# Altium schematic sheet xmega32A4U.SchDoc: xmega32A4U.sch
size 274 x 210 mm; Date: 4/24/2014 9:03:22 PM; DocumentNumber: Document Number:; Revision: REV:; SheetNumber: 1; DATABASE: /Users/jmoreland/.dropbox-alt/Dropbox/eagle/JCM-Eagle/bom/PARTSDB.TXT; DRAWN: Joseph Moreland
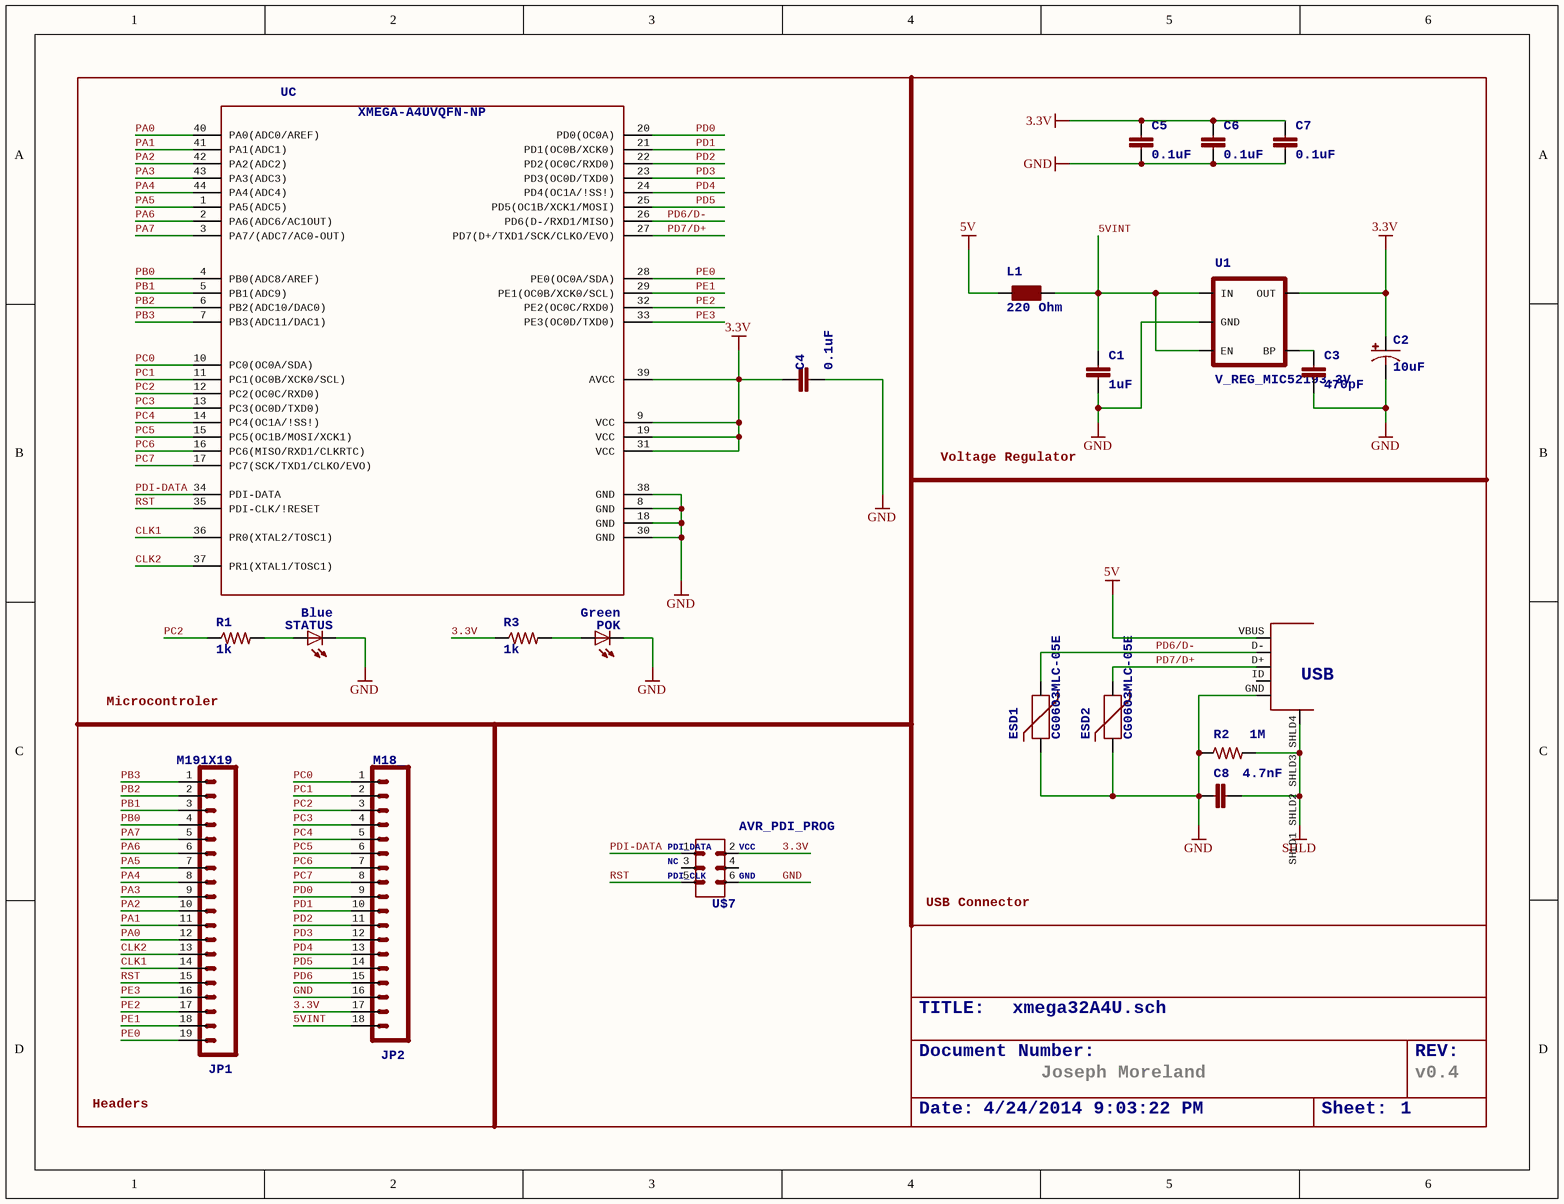
[diagram p0: xmega32A4U.SchDoc]

## Parts
C1  1uF  [0603-CAP]
C2  10uF  [EIA3216]
C3  470pF  [0603-CAP]
C4  0.1uF  [0402-CAP]
C5  0.1uF  [0402-CAP]
C6  0.1uF  [0402-CAP]
C7  0.1uF  [0402-CAP]
C8  4.7nF  [0402-CAP]
ESD1  CG0603MLC-05E  [0603-CHIPGUARD]
ESD2  CG0603MLC-05E  [0603-CHIPGUARD]
JP1  M191X19  [1X19]
JP2  M18_  [1X18]
L1  220 Ohm  [0603]
POK  Green  [LED-0603]
R1  1k  [0603-RES]
R2  1M  [0402-RES]
R3  1k  [0603-RES]
STATUS  Blue  [LED-0603]
U1  V_REG_MIC52193.3V  [SOT23-5]
U$4  USB-MINIB  [USB-MINI-B-UX60-MB-5S8]  (value not drawn)
U$7  AVR_PDI_PROG  [AVR_50MIL_PROG]
UC  XMEGA-A4UVQFN-NP  [QFN44-NOPAD]

## Nets
3.3V: C2.A(+) C4.1 C5.1 C6.1 C7.1 JP2.17 R3.1 U1.5(OUT) U$7.2(VCC) UC.9(VCC) UC.19(VCC) UC.31(VCC) UC.39(AVCC)
5V: L1.1 U$4.VBUS
GND: C1.2 C2.C(-) C3.2 C4.2 C5.2 C6.2 C7.2 C8.1 ESD1.P$1 ESD2.P$1 JP2.16 POK.C R2.1 STATUS.C U1.2(GND) U$4.GND U$7.6(GND) UC.8(GND) UC.18(GND) UC.30(GND) UC.38(GND)
SHLD: C8.2 R2.2 U$4.SHLD1_SHLD2_SHLD3_SHLD4(SHLD)
5VINT: C1.1 JP2.18 L1.2 U1.1(IN) U1.3(EN)
CLK1: JP1.14 UC.36(PR0(XTAL2/TOSC1))
CLK2: JP1.13 UC.37(PR1(XTAL1/TOSC1))
PA0: JP1.12 UC.40(PA0(ADC0/AREF))
PA1: JP1.11 UC.41(PA1(ADC1))
PA2: JP1.10 UC.42(PA2(ADC2))
PA3: JP1.9 UC.43(PA3(ADC3))
PA4: JP1.8 UC.44(PA4(ADC4))
PA5: JP1.7 UC.1(PA5(ADC5))
PA6: JP1.6 UC.2(PA6(ADC6/AC1OUT))
PA7: JP1.5 UC.3(PA7/(ADC7/AC0-OUT))
PB0: JP1.4 UC.4(PB0(ADC8/AREF))
PB1: JP1.3 UC.5(PB1(ADC9))
PB2: JP1.2 UC.6(PB2(ADC10/DAC0))
PB3: JP1.1 UC.7(PB3(ADC11/DAC1))
PC0: JP2.1 UC.10(PC0(OC0A/SDA))
PC1: JP2.2 UC.11(PC1(OC0B/XCK0/SCL))
PC2: JP2.3 R1.1 UC.12(PC2(OC0C/RXD0))
PC3: JP2.4 UC.13(PC3(OC0D/TXD0))
PC4: JP2.5 UC.14(PC4(OC1A/!SS!))
PC5: JP2.6 UC.15(PC5(OC1B/MOSI/XCK1))
PC6: JP2.7 UC.16(PC6(MISO/RXD1/CLKRTC))
PC7: JP2.8 UC.17(PC7(SCK/TXD1/CLKO/EVO))
PD0: JP2.9 UC.20(PD0(OC0A))
PD1: JP2.10 UC.21(PD1(OC0B/XCK0))
PD2: JP2.11 UC.22(PD2(OC0C/RXD0))
PD3: JP2.12 UC.23(PD3(OC0D/TXD0))
PD4: JP2.13 UC.24(PD4(OC1A/!SS!))
PD5: JP2.14 UC.25(PD5(OC1B/XCK1/MOSI))
PD6: JP2.15
PD6/D-: ESD1.P$2 U$4.D- UC.26(PD6(D-/RXD1/MISO))
PD7/D+: ESD2.P$2 U$4.D+ UC.27(PD7(D+/TXD1/SCK/CLKO/EVO))
PDI-DATA: U$7.1(PDI_DATA) UC.34(PDI-DATA)
PE0: JP1.19 UC.28(PE0(OC0A/SDA))
PE1: JP1.18 UC.29(PE1(OC0B/XCK0/SCL))
PE2: JP1.17 UC.32(PE2(OC0C/RXD0))
PE3: JP1.16 UC.33(PE3(OC0D/TXD0))
RST: JP1.15 U$7.5(PDI_CLK) UC.35(PDI-CLK/!RESET)
NetC3_1: C3.1 U1.4(BP)
NetPOK_A: POK.A R3.2
NetR1_2: R1.2 STATUS.A

Not connected (* = marked no-connect by the designer): U$4 ID; U$7 3(NC) 4(NC1)

## Notes on the sheet
- Voltage Regulator
- Microcontroler
- USB Connector
- Joseph Moreland
- v0.4
- Headers

## Library data of the parts
C1 = CAP0603-CAP: <b>Capacitor</b> / Standard 0603 ceramic capacitor, and 0.1" leaded capacitor.; PARTNO: C0603C105K3PACTU
C2 = CAP_POL1206: <b>Capacitor Polarized</b> / These are standard SMD and PTH capacitors. Normally 10uF, 47uF, and 100uF in electrolytic and tantalum varieties. Always verify the external diameter of the through hole cap, it varies with capacity, voltage, and manufacturer. The EIA devices should be standard.; PARTNO: T494A106M020AT
C3 = CAP0603-CAP: <b>Capacitor</b> / Standard 0603 ceramic capacitor, and 0.1" leaded capacitor.; PARTNO: C0603C471K5RACTU
C4 C8 = CAP0402-CAP: <b>Capacitor</b> / Standard 0603 ceramic capacitor, and 0.1" leaded capacitor.
C5-C7 = CAP0402-CAP: <b>Capacitor</b> / Standard 0603 ceramic capacitor, and 0.1" leaded capacitor.; PARTNO: GMK105BJ104KV-F
ESD1 ESD2 = CG0603MLC: ESD suppresor / ChipGuard MLC; PARTNO: CG0603MLC-05E
JP1 = M191X19: 1x19 .1" header; PARTNO: M20-9732046
JP2 = M18_: 1x18 .1" header; PARTNO: 68000-418HLF
L1 = WE-CBF_0603: SMD EMI Suppression Ferrite Beads / - excellent anti-EMI properties / - low DCR / - impedances till 3000 ohms / - rated current up to 6 A; PARTNO: MPZ1608S221A
POK = LED0603: <b>LEDs</b> / Standard schematic elements and footprints for 5mm, 3mm, 1206, and 0603 sized LEDs. 5mm - Spark Fun Electronics SKU : COM-00529 (and others); PARTNO: LTST-C190KGKT
R1 R3 = RESISTOR0603-RES: <b>Resistor</b> / Basic schematic elements and footprints for 0603, 1206, and PTH resistors.; PARTNO: RC0603FR-071KL
R2 = RESISTOR0402-RES: <b>Resistor</b> / Basic schematic elements and footprints for 0603, 1206, and PTH resistors.
STATUS = LED0603: <b>LEDs</b> / Standard schematic elements and footprints for 5mm, 3mm, 1206, and 0603 sized LEDs. 5mm - Spark Fun Electronics SKU : COM-00529 (and others); PARTNO: LTST-C191TBKT
U1 = V_REG_MIC52193.3V: <b>V_REG MIC5219</b> / Standard 500mA LDO voltage regulator in SOT-23 layout. Micrel part MIC5219. BP (by-pass) pin is used to lower output noise with 470pF cap, / may be left open.; PARTNO: MIC5219-3.3YM5 TR; PROD_ID: VREG-09872; VALUE: MIC5219 3.3V
U$4 = USB-MINIB: <b>Mini-USB "B" connector with 5th pin broken out.</b><p> / Created new symbol breaking out 5th "ID" pin in mini/micro USB connector spec.  See: http://en.wikipedia.org/wiki/Mini_usb#Cables.  Uses same footprint as 4-pin symbol.<p> / Also added pins to connect to mounting / shield pads if required (probably not generally needed as signals aren't shielded once they leave the connector).; PARTNO: UX60-MB-5S8; USB: USB
U$7 = AVR_PDI_PROG: PARTNO: LPPB032NFSP-RC; NC: NC; GND: GND; VCC: VCC; PDI_DATA: PDI_DATA; PDI_CLK: PDI_CLK
UC = XMEGA-A4UVQFN-NP: Atmel XMega A4 series processor; PARTNO: ATXMEGA32A4U-MH